# Altium project MicroInverter.PrjPcb
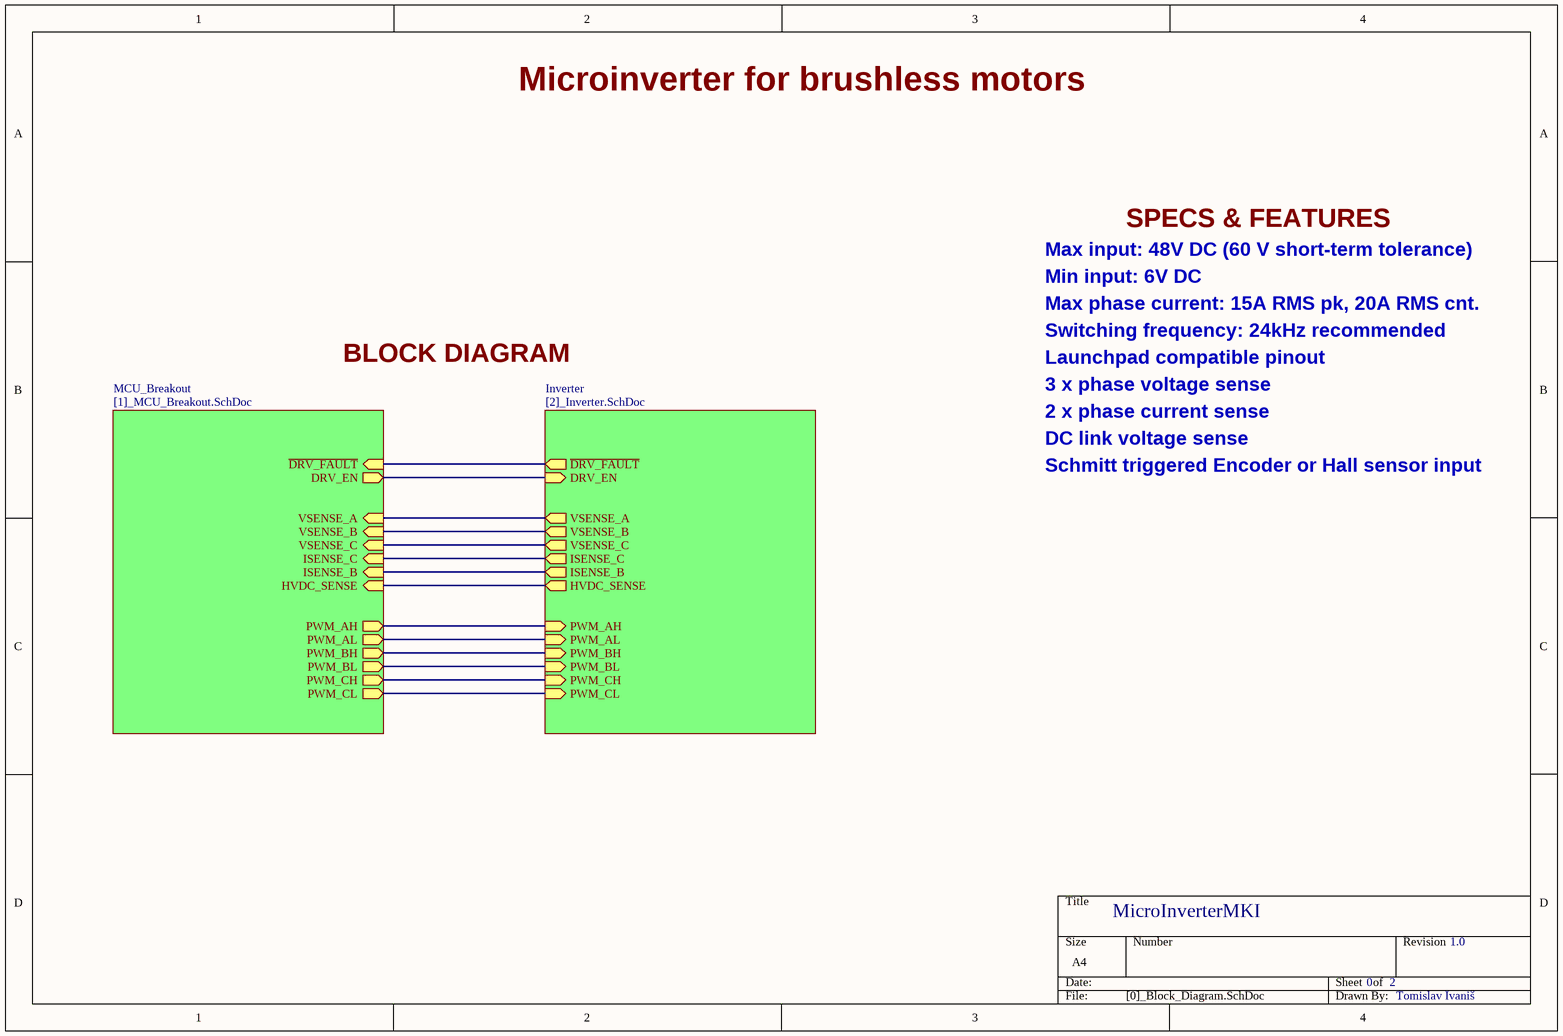
[diagram p0: [0]_Block_Diagram.SchDoc]
Not Fitted: NF
3 sheets, 118 parts. Net scope: hierarchical (ports join the sheet entries above them; power ports are global).
Board file: uInv_PCB.PcbDoc
Sheets:
  [0]_Block_Diagram.SchDoc
    MCU_Breakout = [1]_MCU_Breakout.SchDoc
    Inverter = [2]_Inverter.SchDoc

## Sheet [0]_Block_Diagram.SchDoc
size A4; Author: Tomislav Ivaniš; Engineer: Tomislav Ivaniš

### Sub-sheets
Inverter = [2]_Inverter.SchDoc: ~{DRV_FAULT} (out), DRV_EN (in), VSENSE_A (out), VSENSE_B (out), VSENSE_C (out), ISENSE_C (out), ISENSE_B (out), HVDC_SENSE (out), PWM_AH (in), PWM_AL (in), PWM_BH (in), PWM_BL (in), PWM_CH (in), PWM_CL (in)
MCU_Breakout = [1]_MCU_Breakout.SchDoc: ~{DRV_FAULT} (in), DRV_EN (out), VSENSE_A (in), VSENSE_B (in), VSENSE_C (in), ISENSE_C (in), ISENSE_B (in), HVDC_SENSE (in), PWM_AH (out), PWM_AL (out), PWM_BH (out), PWM_BL (out), PWM_CH (out), PWM_CL (out)

### Nets
~{DRV_FAULT}: sheet MCU_Breakout/~{DRV_FAULT}, sheet Inverter/~{DRV_FAULT}
DRV_EN: sheet MCU_Breakout/DRV_EN, sheet Inverter/DRV_EN
HVDC_SENSE: sheet MCU_Breakout/HVDC_SENSE, sheet Inverter/HVDC_SENSE
ISENSE_B: sheet MCU_Breakout/ISENSE_B, sheet Inverter/ISENSE_B
ISENSE_C: sheet MCU_Breakout/ISENSE_C, sheet Inverter/ISENSE_C
PWM_AH: sheet MCU_Breakout/PWM_AH, sheet Inverter/PWM_AH
PWM_AL: sheet MCU_Breakout/PWM_AL, sheet Inverter/PWM_AL
PWM_BH: sheet MCU_Breakout/PWM_BH, sheet Inverter/PWM_BH
PWM_BL: sheet MCU_Breakout/PWM_BL, sheet Inverter/PWM_BL
PWM_CH: sheet MCU_Breakout/PWM_CH, sheet Inverter/PWM_CH
PWM_CL: sheet MCU_Breakout/PWM_CL, sheet Inverter/PWM_CL
VSENSE_A: sheet MCU_Breakout/VSENSE_A, sheet Inverter/VSENSE_A
VSENSE_B: sheet MCU_Breakout/VSENSE_B, sheet Inverter/VSENSE_B
VSENSE_C: sheet MCU_Breakout/VSENSE_C, sheet Inverter/VSENSE_C

### Notes on the sheet
- Microinverter for brushless motors
- SPECS & FEATURES
- Max input: 48V DC (60 V short-term tolerance)
- Max phase current: 15A RMS pk, 20A RMS cnt.
- Min input: 6V DC
- BLOCK DIAGRAM
- Launchpad compatible pinout
- Switching frequency: 24kHz recommended
- 3 x phase voltage sense
- 2 x phase current sense
- DC link voltage sense
- Schmitt triggered Encoder or Hall sensor input
- MicroInverterMKI
- 0
- 2
- 1.0

## Sheet [1]_MCU_Breakout.SchDoc
size A4; Author: Tomislav Ivaniš; Engineer: Tomislav Ivaniš
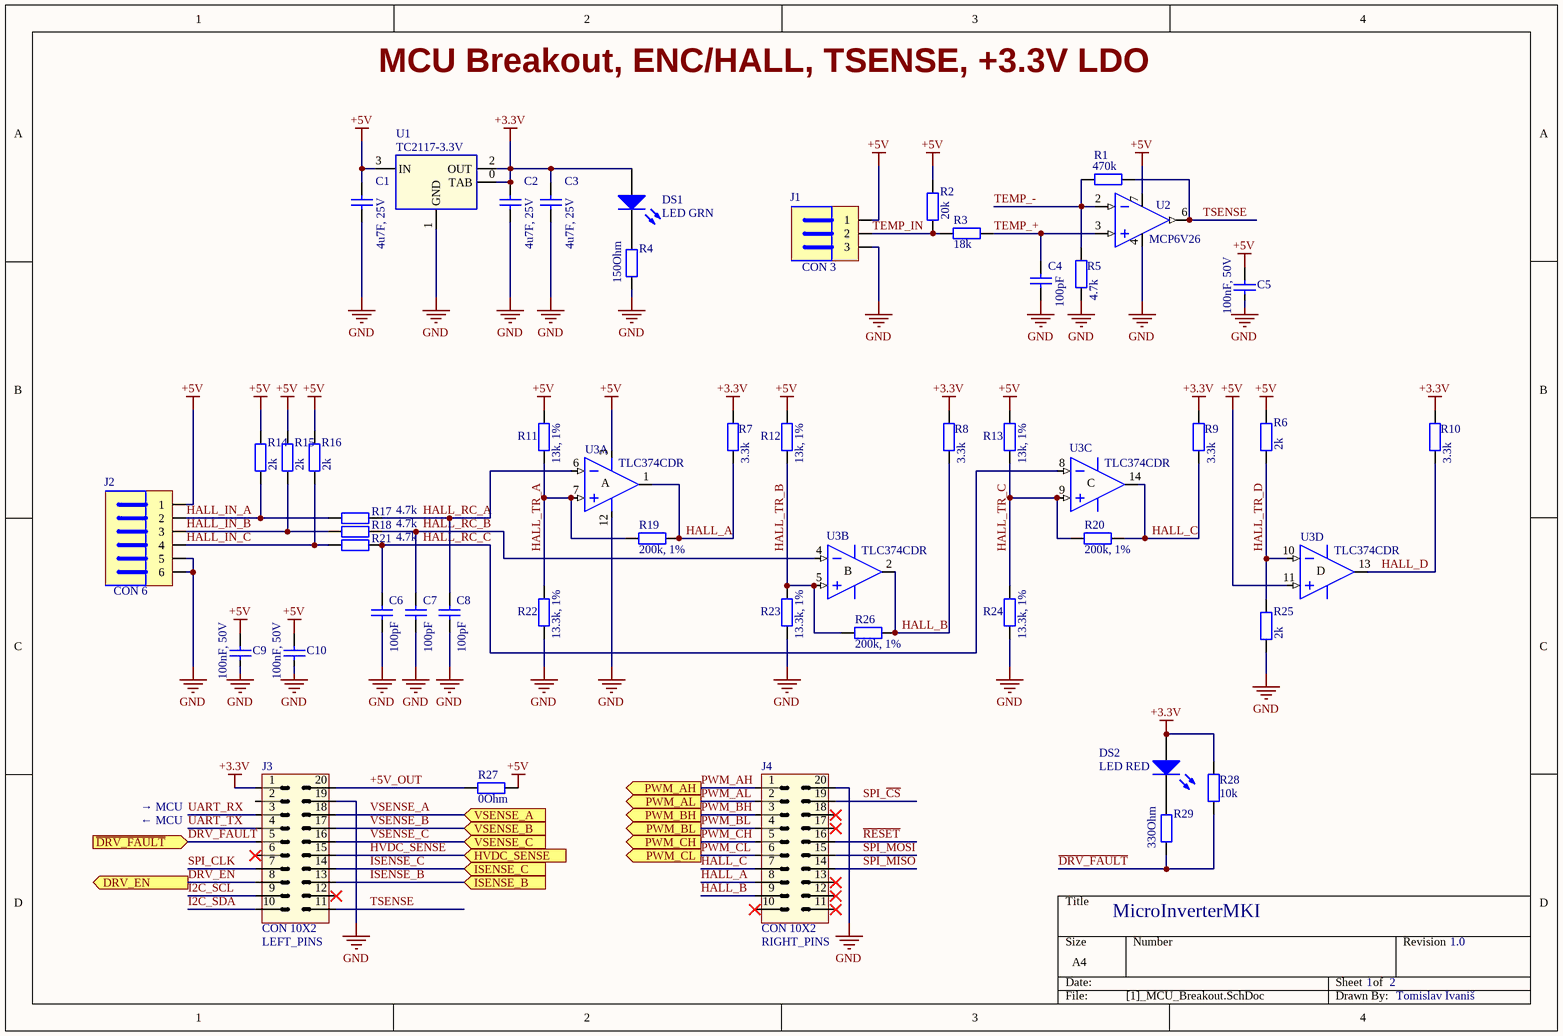
[diagram p1: [1]_MCU_Breakout.SchDoc]

### Parts
C1  4u7F, 25V  [0805]
C2  4u7F, 25V  [0805]
C3  4u7F, 25V  [0805]
C4  100pF  [0603]
C5  100nF, 50V  [0603]
C6  100pF  [0603]
C7  100pF  [0603]
C8  100pF  [0603]
C9  100nF, 50V  [0603]
C10  100nF, 50V  [0603]
DS1  LED GRN  [0805LED]
DS2  LED RED  [0805LED]
J1  CON 3  [CON 3 MOLEX SL]
J2  CON 6  [CON 6 MOLEX SL]
J3  CON 10X2  [CON 20 HEADER - (ALT) - INVERTED]
J4  CON 10X2  [CON 20 HEADER - (ALT) - INVERTED]
R1  470k  [0805]
R2  20k  [0805]
R3  18k  [0805]
R4  150Ohm  [0805]
R5  4.7k  [0805]
R6  2k  [0805]
R7  3.3k  [0805]
R8  3.3k  [0805]
R9  3.3k  [0805]
R10  3.3k  [0805]
R11  13k, 1%  [0805]
R12  13k, 1%  [0805]
R13  13k, 1%  [0805]
R14  2k  [0805]
R15  2k  [0805]
R16  2k  [0805]
R17  4.7k  [0805]
R18  4.7k  [0805]
R19  200k, 1%  [0805]
R20  200k, 1%  [0805]
R21  4.7k  [0805]
R22  13.3k, 1%  [0805]
R23  13.3k, 1%  [0805]
R24  13.3k, 1%  [0805]
R25  2k  [0805]
R26  200k, 1%  [0805]
R27  0Ohm  [0805]
R28  10k  [0805]
R29  330Ohm  [0805]
U1  TC2117-3.3V  [SOT223 (ZLDO)]
U2  MCP6V26  [SOIC 8-pin]
U3  TLC374CDR  [SOIC14]  (parts A,B,C,D of 4)

### Ports
DRV_EN (out), HVDC_SENSE (in), ISENSE_B (in), ISENSE_C (in), PWM_AH (out), PWM_AL (out), PWM_BH (out), PWM_BL (out), PWM_CH (out), PWM_CL (out), VSENSE_A (in), VSENSE_B (in), VSENSE_C (in), ~{DRV_FAULT} (in)

### Nets
+3.3V: C2.1 C3.1 DS1.2(A) DS2.2(A) J3.1 R7.1 R8.1 R9.1 R10.1 R28.2 U1.0(TAB) U1.2(OUT)
+5V: C1.1 C5.1 C9.1 C10.1 J1.1 J2.1 R2.1 R6.1 R11.1 R12.1 R13.1 R14.1 R15.1 R16.1 R27.2 U1.3(IN) U2.7 U3.3(VDD) U3.11(IN+)
GND: C1.2 C2.2 C3.2 C4.2 C5.2 C6.2 C7.2 C8.2 C9.2 C10.2 J1.3 J2.5 J2.6 J3.19 J4.20 R4.2 R5.1 R22.2 R23.2 R24.2 R25.2 U1.1(GND) U2.4 U3.12(GND)
+5V_OUT: J3.20 R27.1
~{DRV_FAULT}: J3.5 R28.1 R29.2 ; port ~{DRV_FAULT}
DRV_EN: J3.8 ; port DRV_EN
HALL_A: J4.8 R7.2 R19.2 U3.1(OUT)
HALL_B: J4.9 R8.2 R26.2 U3.2(OUT)
HALL_C: J4.7 R9.2 R20.2 U3.14(OUT)
HALL_D: R10.2 U3.13(OUT)
HALL_IN_A: J2.2 R14.2 R17.1
HALL_IN_B: J2.3 R15.2 R18.1
HALL_IN_C: J2.4 R16.2 R21.1
HALL_RC_A: C8.1 R17.2 U3.6(IN-)
HALL_RC_B: C7.1 R18.2 U3.4(IN-)
HALL_RC_C: C6.1 R21.2 U3.8(IN-)
HALL_TR_A: R11.2 R19.1 R22.1 U3.7(IN+)
HALL_TR_B: R12.2 R23.1 R26.1 U3.5(IN+)
HALL_TR_C: R13.2 R20.1 R24.1 U3.9(IN+)
HALL_TR_D: R6.2 R25.1 U3.10(IN-)
HVDC_SENSE: J3.15 ; port HVDC_SENSE
I2C_SCL: J3.9
I2C_SDA: J3.10
ISENSE_B: J3.13 ; port ISENSE_B
ISENSE_C: J3.14 ; port ISENSE_C
PWM_AH: J4.1 ; port PWM_AH
PWM_AL: J4.2 ; port PWM_AL
PWM_BH: J4.3 ; port PWM_BH
PWM_BL: J4.4 ; port PWM_BL
PWM_CH: J4.5 ; port PWM_CH
PWM_CL: J4.6 ; port PWM_CL
~{RESET}: J4.16
SPI_~{CS}: J4.19
SPI_CLK: J3.7
SPI_MISO: J4.14
SPI_MOSI: J4.15
TEMP_+: C4.1 R3.2 U2.3(IN+)
TEMP_-: R1.2 R5.2 U2.2(IN-)
TEMP_IN: J1.2 R2.2 R3.1
TSENSE: J3.11 R1.1 U2.6(OUT)
UART_RX: J3.3
UART_TX: J3.4
VSENSE_A: J3.18 ; port VSENSE_A
VSENSE_B: J3.17 ; port VSENSE_B
VSENSE_C: J3.16 ; port VSENSE_C
NetDS1_1: DS1.1(K) R4.1
NetDS2_1: DS2.1(K) R29.1

Not connected (* = marked no-connect by the designer): J3 2 6* 12*; J4 10* 11* 12* 13* 17* 18*

### Notes on the sheet
- MCU Breakout, ENC/HALL, TSENSE, +3.3V LDO
- → MCU
- ← MCU
- MicroInverterMKI
- (near J3) LEFT_PINS
- (near J4) RIGHT_PINS
- 1
- 2
- 1.0
- (in symbol Comparator Quad, part A) A
- (in symbol Comparator Quad, part B) B
- (in symbol Comparator Quad, part C) C
- (in symbol Comparator Quad, part D) D

### Library data of the parts
C1-C3 = Cap Semi: Capacitor; Manufacturer Part Number: 885012107018
C4 C6-C8 = Cap Semi: 885012006036; Manufacturer part number: GCM0335C1E101GA16D
C5 C9 C10 = Cap Semi: Capacitor; Manufacturer Part Number: C0603C104M5RACTU
DS1 = LED: Typical RED, GREEN, YELLOW, AMBER GaAs LED; Manufacturer part number: LTST-S220GKT
DS2 = LED: Typical RED, GREEN, YELLOW, AMBER GaAs LED; Manufacturer part number: LTST-C170KRKT
J1 = CON 3 SIL Angle: Manufacturer part number: 70553-0002
J2 = CON 6 SIL Angle: Manufacturer part number: 70553-0040
J3 J4 = CON 10X2: Manufacturer part number: 68683-305LF
R1 = Res: CR0805-JW-680ELF; Manufacturer part number: CR0805-FX-4703ELF
R2 = Res: CR0805-JW-680ELF; Manufacturer part number: CR0805-FX-2002ELF
R3 = Res: CR0805-JW-680ELF; Manufacturer part number: CR0805-FX-1802ELF
R4 = Res: CR0805-JW-680ELF; Manufacturer part number: CR0805-JW-151ELF
R5 R17 R18 R21 = Res: CR0805-JW-680ELF; Manufacturer part number: CR0805-FX-4701ELF
R6 R14-R16 R25 = Res: CR0805-JW-680ELF; Manufacturer part number: CR0805-FX-2001ELF
R7-R10 = Res: CR0805-JW-680ELF; Manufacturer part number: CR0805-FX-3301ELF
R11-R13 = Res: CR0805-JW-680ELF; Manufacturer part number: CR0805-FX-1302ELF
R19 R20 R26 = Res: CR0805-JW-680ELF; Manufacturer part number: CR0805-FX-2003ELF
R22-R24 = Res: CR0805-JW-680ELF; Manufacturer part number: CR0805-FX-1332ELF
R27 = Res: Resistor; Manufacturer Part Number: CR0805-J/-000ELF
R28 = Res: CR0805-JW-680ELF; Manufacturer part number: CR0805-FX-1002ELF
R29 = Res: CR0805-JW-680ELF; Manufacturer part number: CR0805-FX-3300ELF
U1 = 1117: Linear regulator; Manufacturer part number: TC2117-3.3VDBTR
U2 = OP_AMP_SINGLE_SOIC: Manufacturer Part Number: MCP6V26-E/MS
U3 = Comparator Quad: Comparator, quad, open drain; Manufacturer Part Number: TLC374CDR

## Sheet [2]_Inverter.SchDoc
size A4; Author: Tomislav Ivaniš; DrawnBy: Tomislav Ivaniš; Revision: 1; ProjectName: MicroInverterMKI
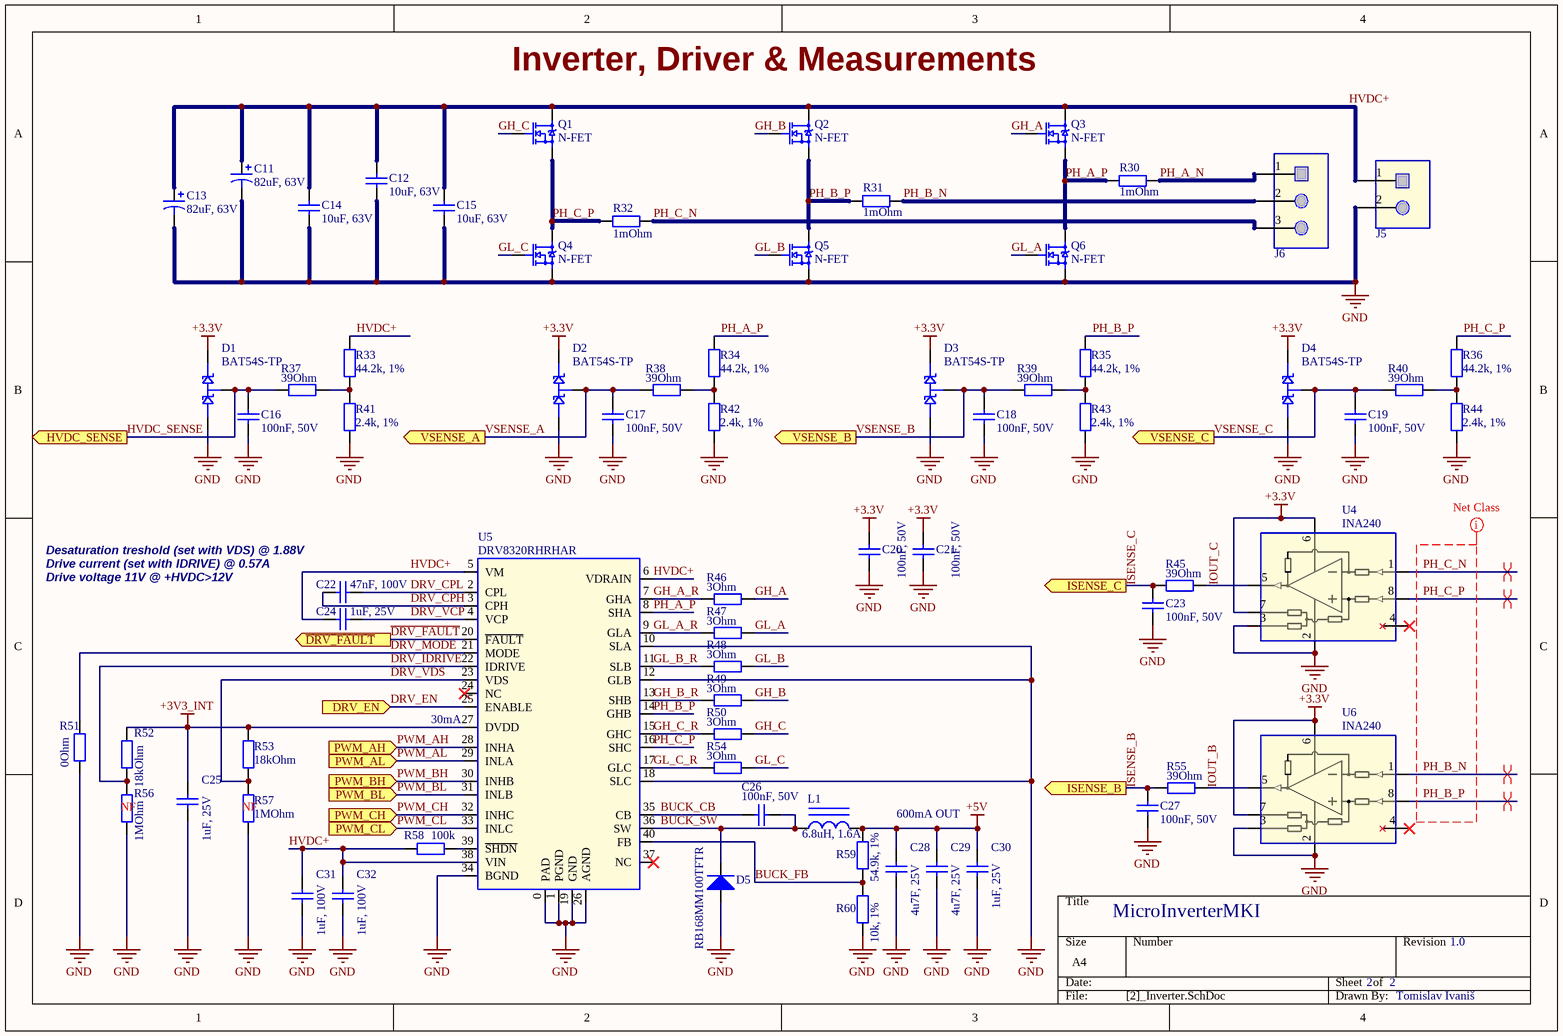
[diagram p2: [2]_Inverter.SchDoc]

### Parts
C11  82uF, 63V  [CAP_H10]
C12  10uF, 63V  [1210]
C13  82uF, 63V  [CAP_H10]
C14  10uF, 63V  [1210]
C15  10uF, 63V  [1210]
C16  100nF, 50V  [0603]
C17  100nF, 50V  [0603]
C18  100nF, 50V  [0603]
C19  100nF, 50V  [0603]
C20  100nF, 50V  [0603]
C21  100nF, 50V  [0603]
C22  47nF, 100V  [0805]
C23  100nF, 50V  [0603]
C24  1uF, 25V  [0805]
C25  1uF, 25V  [0805]
C26  100nF, 50V  [0603]
C27  100nF, 50V  [0603]
C28  4u7F, 25V  [0805]
C29  4u7F, 25V  [0805]
C30  1uF, 25V  [0805]
C31  1uF, 100V  [0805]
C32  1uF, 100V  [0805]
D1  BAT54S-TP  [SOT 23]
D2  BAT54S-TP  [SOT 23]
D3  BAT54S-TP  [SOT 23]
D4  BAT54S-TP  [SOT 23]
D5  RB168MM100TFTR  [SOD123]
J5  TERMINAL 2  [TERMINAL 2 POS]  (value not drawn)
J6  TERMINAL 3  [TERMINAL 3 POS]  (value not drawn)
L1  6.8uH, 1.6A  [INDUCTOR - 4x4 mm]
Q1  N-FET  [SO-8FL]
Q2  N-FET  [SO-8FL]
Q3  N-FET  [SO-8FL]
Q4  N-FET  [SO-8FL]
Q5  N-FET  [SO-8FL]
Q6  N-FET  [SO-8FL]
R30  1mOhm  [RES TLR2HW CURRENT SENSE]
R31  1mOhm  [RES TLR2HW CURRENT SENSE]
R32  1mOhm  [RES TLR2HW CURRENT SENSE]
R33  44.2k, 1%  [0805]
R34  44.2k, 1%  [0805]
R35  44.2k, 1%  [0805]
R36  44.2k, 1%  [0805]
R37  39Ohm  [0805]
R38  39Ohm  [0805]
R39  39Ohm  [0805]
R40  39Ohm  [0805]
R41  2.4k, 1%  [0805]
R42  2.4k, 1%  [0805]
R43  2.4k, 1%  [0805]
R44  2.4k, 1%  [0805]
R45  39Ohm  [0805]
R46  3Ohm  [0805]
R47  3Ohm  [0805]
R48  3Ohm  [0805]
R49  3Ohm  [0805]
R50  3Ohm  [0805]
R51  0Ohm  [0805]
R52  18kOhm  [0805]
R53  18kOhm  [0805]
R54  3Ohm  [0805]
R55  39Ohm  [0805]
R56  1MOhm  [0805]
R57  1MOhm  [0805]
R58  100k  [0805]
R59  54.9k, 1%  [0805]
R60  10k, 1%  [0805]
U4  INA240  [SO 8 - HighDensity]
U5  DRV8320RHRHAR  [VQFN-40]
U6  INA240  [SO 8 - HighDensity]

### Ports
DRV_EN (in), HVDC_SENSE (out), ISENSE_B (out), ISENSE_C (out), PWM_AH (in), PWM_AL (in), PWM_BH (in), PWM_BL (in), PWM_CH (in), PWM_CL (in), VSENSE_A (out), VSENSE_B (out), VSENSE_C (out), ~{DRV_FAULT} (out)

### Nets
+3.3V: C20.1 C21.1 D1.3(K) D2.3(K) D3.3(K) D4.3(K) U4.6 U4.7 U6.6 U6.7
+3V3_INT: C25.1 R52.2 R53.2 U5.27(DVDD)
+5V: C28.1 C29.1 C30.1 L1.2 R59.2
GND: C11.1 C12.2 C13.1 C14.2 C15.2 C16.2 C17.2 C18.2 C19.2 C20.2 C21.2 C23.2 C25.2 C27.2 C28.2 C29.2 C30.2 C31.2 C32.2 D1.2(A) D2.2(A) D3.2(A) D4.2(A) D5.1(A) J5.2 Q4.3 Q5.3 Q6.3 R41.1 R42.1 R43.1 R44.1 R51.1 R56.1 R57.1 R60.1 U4.2 U4.3 U5.0(PAD) U5.1(PGND) U5.10(SLA) U5.12(GLB) U5.18(SLC) U5.19(GND) U5.26(AGND) U5.34(BGND) U6.2 U6.3
BUCK_CB: C26.2 U5.35(CB)
BUCK_FB: R59.1 R60.2 U5.40(FB)
BUCK_SW: C26.1 D5.2(K) L1.1 U5.36(SW)
~{DRV_FAULT}: U5.20(~{FAULT}) ; port ~{DRV_FAULT}
DRV_CPH: C22.1 U5.3(CPH)
DRV_CPL: C22.2 U5.2(CPL)
DRV_EN: U5.25(ENABLE) ; port DRV_EN
DRV_IDRIVE: R52.1 R56.2 U5.22(IDRIVE)
DRV_MODE: R51.2 U5.21(MODE)
DRV_VCP: C24.1 U5.4(VCP)
DRV_VDS: R53.1 R57.2 U5.23(VDS)
GH_A: Q3.1 R46.2
GH_A_R: R46.1 U5.7(GHA)
GH_B: Q2.1 R49.2
GH_B_R: R49.1 U5.13(SHB)
GH_C: Q1.1 R50.2
GH_C_R: R50.1 U5.15(GHC)
GL_A: Q6.1 R47.2
GL_A_R: R47.1 U5.9(GLA)
GL_B: Q5.1 R48.2
GL_B_R: R48.1 U5.11(SLB)
GL_C: Q4.1 R54.2
GL_C_R: R54.1 U5.17(GLC)
HVDC+: C11.2 C12.1 C13.2 C14.1 C15.1 C24.2 C31.1 C32.1 J5.1 Q1.2 Q2.2 Q3.2 R33.2 R58.2 U5.5(VM) U5.6(VDRAIN) U5.38(VIN)
HVDC_SENSE: C16.1 D1.1(KA) R37.1 ; port HVDC_SENSE
IOUT_B: R55.2 U6.5(OUT)
IOUT_C: R45.2 U4.5(OUT)
ISENSE_B: C27.1 R55.1 ; port ISENSE_B
ISENSE_C: C23.1 R45.1 ; port ISENSE_C
PH_A_N: J6.1 R30.2
PH_A_P: Q3.3 Q6.2 R30.1 R34.2 U5.8(SHA)
PH_B_N: J6.2 R31.2 U6.1(IN-)
PH_B_P: Q2.3 Q5.2 R31.1 R35.2 U5.14(GHB) U6.8(IN+)
PH_C_N: J6.3 R32.2 U4.1(IN-)
PH_C_P: Q1.3 Q4.2 R32.1 R36.2 U4.8(IN+) U5.16(SHC)
PWM_AH: U5.28(INHA) ; port PWM_AH
PWM_AL: U5.29(INLA) ; port PWM_AL
PWM_BH: U5.30(INHB) ; port PWM_BH
PWM_BL: U5.31(INLB) ; port PWM_BL
PWM_CH: U5.32(INHC) ; port PWM_CH
PWM_CL: U5.33(INLC) ; port PWM_CL
VSENSE_A: C17.1 D2.1(KA) R38.1 ; port VSENSE_A
VSENSE_B: C18.1 D3.1(KA) R39.1 ; port VSENSE_B
VSENSE_C: C19.1 D4.1(KA) R40.1 ; port VSENSE_C
NetR33_1: R33.1 R37.2 R41.2
NetR34_1: R34.1 R38.2 R42.2
NetR35_1: R35.1 R39.2 R43.2
NetR36_1: R36.1 R40.2 R44.2
NetR58_1: R58.1 U5.39(~{SHDN})

Not connected (* = marked no-connect by the designer): U4 4(NC)*; U5 24(NC)* 37(NC)*; U6 4(NC)*

### Layout directives
differential pair; net class DIFF75: PH_B_N, PH_B_P, PH_C_N, PH_C_P
net class DIFF_RSENSE: PH_B_N, PH_B_P, PH_C_N, PH_C_P

### Notes on the sheet
- Inverter, Driver & Measurements
- Desaturation treshold (set with VDS) @ 1.88V
- Drive current (set with IDRIVE) @ 0.57A
- Drive voltage 11V @ +HVDC>12V
- (near U5) 30mA
- 600mA OUT
- MicroInverterMKI
- 2
- 1.0

### Library data of the parts
C11 C13 = Cap Pol: Capacitor Polarized; Manufacturer Part Number: HHXC630ARA820MJA0G
C12 C14 C15 = Cap Semi: Capacitor; Manufacturer Part Number: GRM32ER71J106KA12L
C16-C21 C23 C26 C27 = Cap Semi: as C5 on sheet [1]_MCU_Breakout
C22 = Cap Semi: Capacitor; Manufacturer Part Number: CC0805KKX7R0BB473
C24 C25 C30 = Cap Semi: Capacitor; Manufacturer Part Number: VJ0805Y105KXXTW1BC
C28 C29 = Cap Semi: as C1 on sheet [1]_MCU_Breakout
C31 C32 = Cap Semi: Capacitor; Manufacturer Part Number: HMK212BBJ105KG-TE
D5 = Diode: Manufacturer Part Number: RB168MM100TFTR
J5 = TERMINAL 2: TERMINAL BLOCK 2 POS; Manufacturer part number: *
J6 = TERMINAL 3: TERMINAL BLOCK 3 POS; Manufacturer part number: *
L1 = Inductor Iron: Magnetic-Core Inductor; Manufacturer Part Number: TYS40306R8M-10
Q1-Q6 = N-FET: Manufacturer Part Number: NVMFS6H800NT1G
R30-R32 = Res: Resistor; Manufacturer Part Number: TLR2HWDTE1L00F50
R33-R36 = Res: Resistor; Manufacturer Part Number: CR0805-FX-4422ELF
R37-R40 R45 R55 = Res: Resistor; Manufacturer Part Number: CR0805-JW-390ELF
R41-R44 = Res: Resistor; Manufacturer Part Number: CR0805-FX-2401ELF
R46-R50 R54 = Res: Resistor; Manufacturer Part Number: SG73P2ATTD3R00F
R51 = Res: as R27 on sheet [1]_MCU_Breakout
R52 R53 = Res: Resistor; Manufacturer Part Number: CR0805-FX-1802ELF
R56 R57 = Res: Resistor; Manufacturer Part Number: CR0805-FW-1005ELF
R58 = Res: Resistor; Manufacturer Part Number: CR0805-FX-1003ELF
R59 = Res: Resistor; Manufacturer Part Number: CR0805-FX-5492ELF
R60 = Res: Resistor; Manufacturer Part Number: CR0805-FX-1002ELF
U4 U6 = INA240: Manufacturer part number: INA240A2DR
U5 = DRV8320RHRHAR: 3f Gate driver 60V; Manufacturer part number: DRV8320RHRHAR
D1-D4 = BAT54S-TP: Manufacturer part number: BAT54S-TP

## Nets that join several sheets
+3.3V: [1]_MCU_Breakout (12 pins), [2]_Inverter (10 pins)
+5V: [1]_MCU_Breakout (19 pins), [2]_Inverter (5 pins)
GND: [1]_MCU_Breakout (24 pins), [2]_Inverter (48 pins)
~{DRV_FAULT}: [1]_MCU_Breakout (J3.5 R28.1 R29.2), [2]_Inverter (U5.20)
DRV_EN: [1]_MCU_Breakout (J3.8), [2]_Inverter (U5.25)
HVDC_SENSE: [1]_MCU_Breakout (J3.15), [2]_Inverter (C16.1 D1.1 R37.1)
ISENSE_B: [1]_MCU_Breakout (J3.13), [2]_Inverter (C27.1 R55.1)
ISENSE_C: [1]_MCU_Breakout (J3.14), [2]_Inverter (C23.1 R45.1)
PWM_AH: [1]_MCU_Breakout (J4.1), [2]_Inverter (U5.28)
PWM_AL: [1]_MCU_Breakout (J4.2), [2]_Inverter (U5.29)
PWM_BH: [1]_MCU_Breakout (J4.3), [2]_Inverter (U5.30)
PWM_BL: [1]_MCU_Breakout (J4.4), [2]_Inverter (U5.31)
PWM_CH: [1]_MCU_Breakout (J4.5), [2]_Inverter (U5.32)
PWM_CL: [1]_MCU_Breakout (J4.6), [2]_Inverter (U5.33)
VSENSE_A: [1]_MCU_Breakout (J3.18), [2]_Inverter (C17.1 D2.1 R38.1)
VSENSE_B: [1]_MCU_Breakout (J3.17), [2]_Inverter (C18.1 D3.1 R39.1)
VSENSE_C: [1]_MCU_Breakout (J3.16), [2]_Inverter (C19.1 D4.1 R40.1)

## Assembly variants
Default Variant of Microinverter: not fitted R? R?